# EAGLE design Nixie Clock Main Board V1.1 (EAGLE 9.6.0)
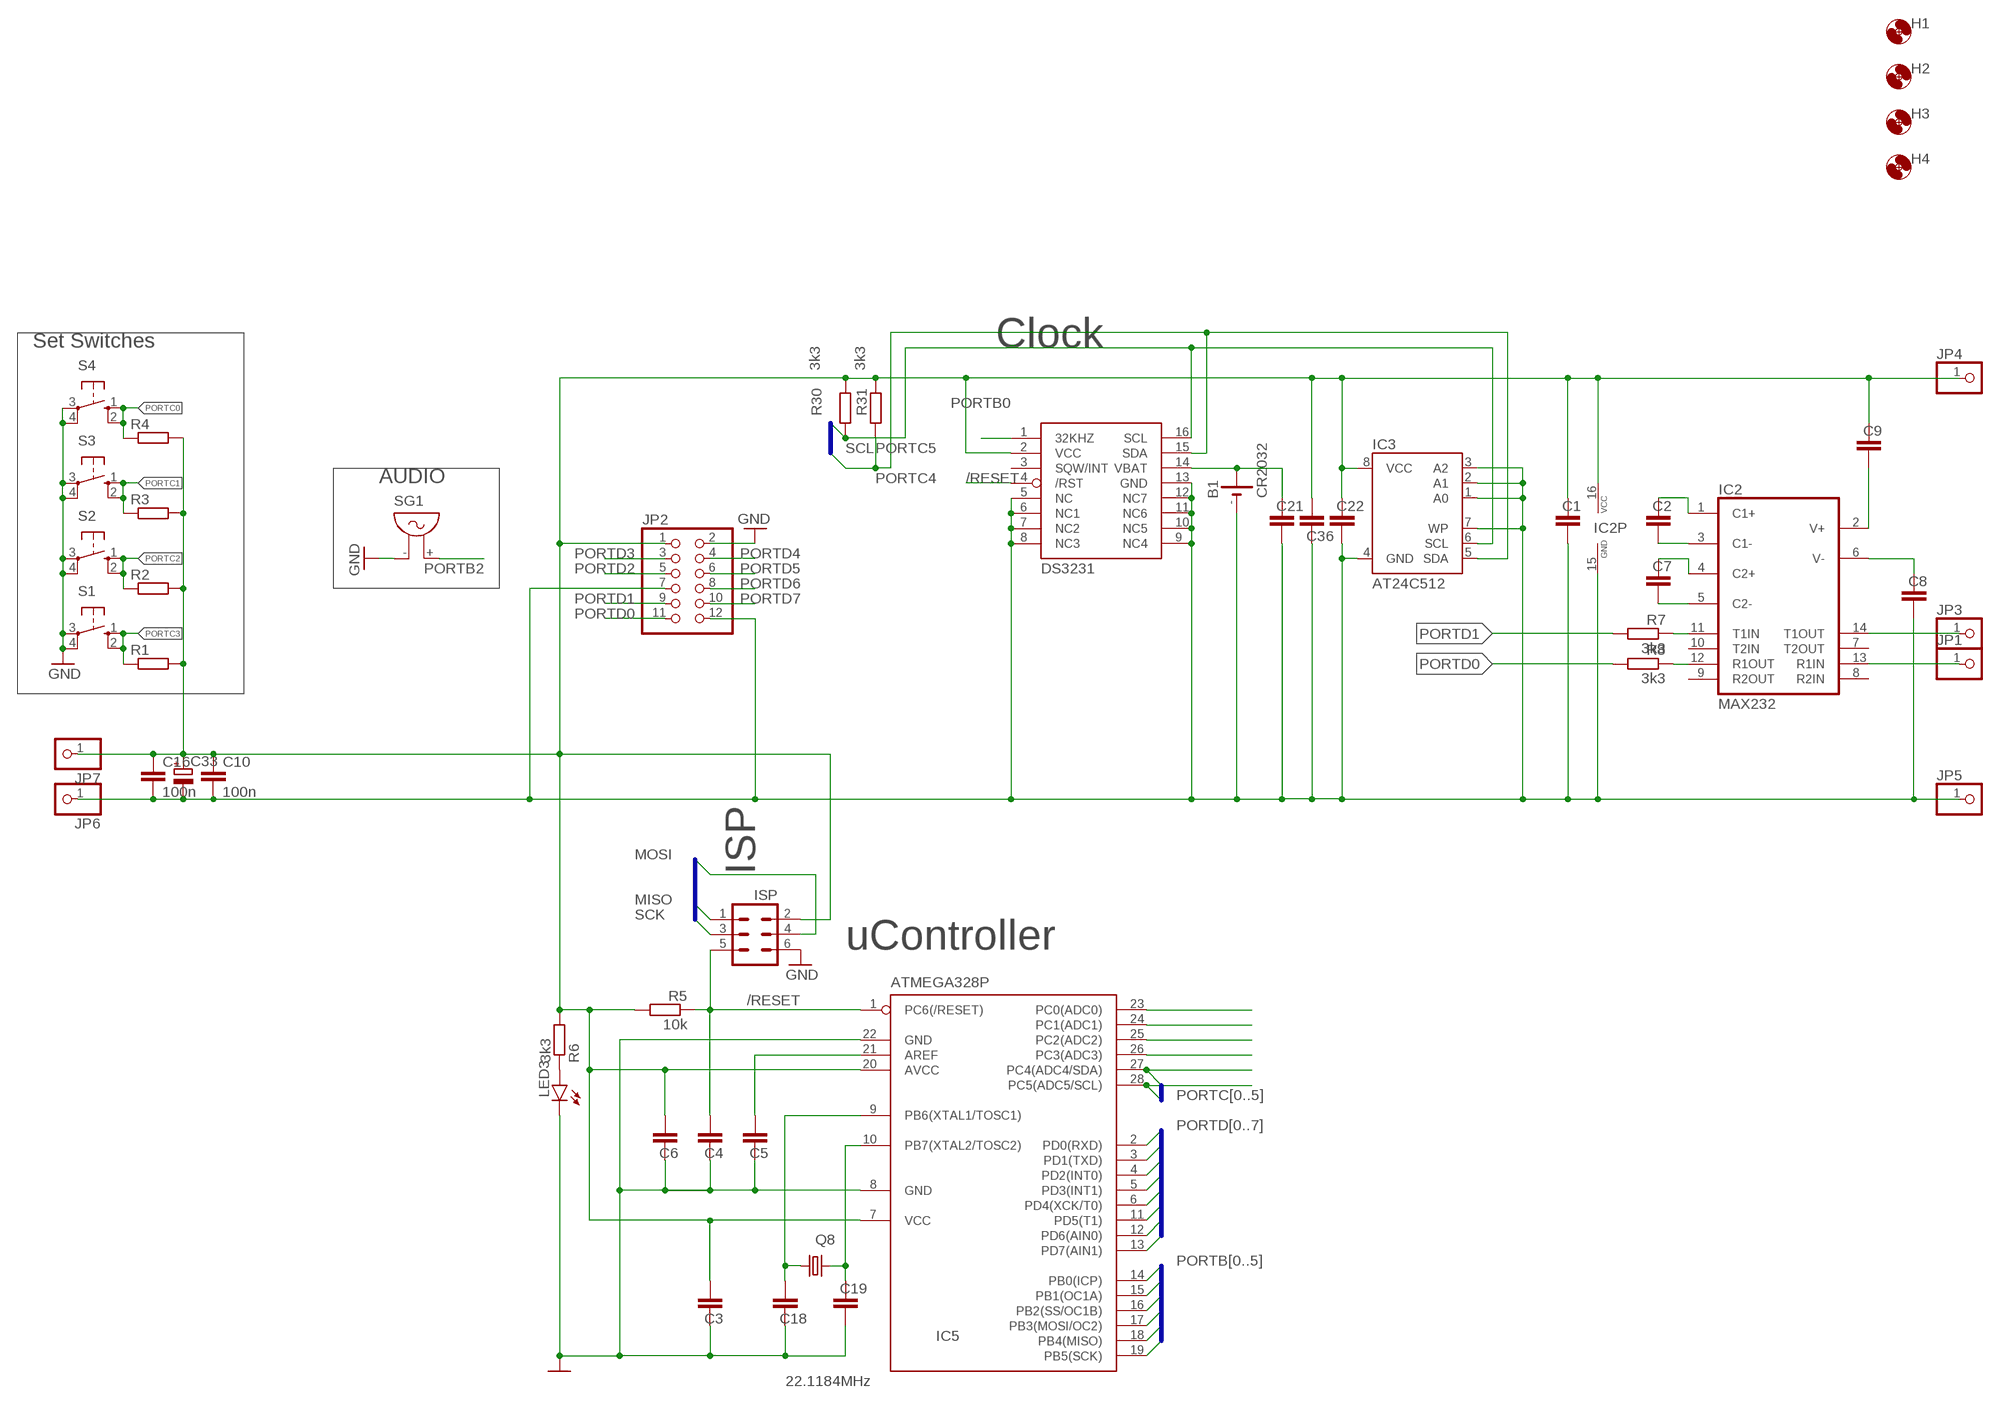
[diagram p0: schematic, sheet 1]

## Parts
B1  CR2032  [CR2032]
C1  C-EUC1206  [C1206]
C2  C-EUC1206  [C1206]
C3  C-EUC1206  [C1206]
C4  C-EUC0805  [C0805]
C5  C-EUC1206  [C1206]
C6  C-EUC1206  [C1206]
C7  C-EUC1206  [C1206]
C8  C-EUC1206  [C1206]
C9  C-EUC1206  [C1206]
C10  100n  C-EUC1206  [C1206]
C16  100n  C-EUC1206  [C1206]
C18  C-EUC0805  [C0805]
C19  C-EUC0805  [C0805]
C21  C-EUC1206  [C1206]
C22  C-EUC1206  [C1206]
C33  CPOL-EUE3.5-8  [E3,5-8]
C36  C-EUC1206  [C1206]
H1  MOUNT-HOLE3.2  [3,2]
H2  MOUNT-HOLE3.2  [3,2]
H3  MOUNT-HOLE3.2  [3,2]
H4  MOUNT-HOLE3.2  [3,2]
IC2  MAX232  [DIL16]
IC3  AT24C512  AT24CP  [DIL08]
IC5  ATMEGA328P  MEGA8-P  [DIL28-3]
J  ISP  MA03-2  [MA03-2]
JP1  PINHD-1X1  [1X01]
JP2  PINHD-2X6  [2X06]
JP3  PINHD-1X1  [1X01]
JP4  PINHD-1X1  [1X01]
JP5  PINHD-1X1  [1X01]
JP6  PINHD-1X1  [1X01]
JP7  PINHD-1X1  [1X01]
LED3  LED5MM  [LED5MM]
Q8  22.1184MHz  CRYSTALHC49U-V  [HC49U-V]
R1  R-EU_R0805  [R0805]
R2  R-EU_R0805  [R0805]
R3  R-EU_R0805  [R0805]
R4  R-EU_R0805  [R0805]
R5  10k  R-EU_R0805  [R0805]
R6  3k3  R-EU_R0805  [R0805]
R7  3k3  R-EU_R0805  [R0805]
R8  3k3  R-EU_R0805  [R0805]
R30  3k3  R-EU_R0805  [R0805]
R31  3k3  R-EU_R0805  [R0805]
S1  10-XX  [B3F-10XX]
S2  10-XX  [B3F-10XX]
S3  10-XX  [B3F-10XX]
S4  10-XX  [B3F-10XX]
SG1  F/QMX  [F/QMX]
U2  DS3231  DS3231/SO  [SO16W]

## Nets
+5V: C1.1 C3.1 C6.1 C9.1 C10.1 C16.1 C22.1 C33.+ C36.1 IC2.16(VCC) IC3.8(VCC) IC5.7(VCC) IC5.20(AVCC) J.2 JP2.1 JP4.1 JP7.1 R1.2 R2.2 R3.2 R4.2 R5.2 R6.2 R30.2 R31.2 U2.2(VCC)
/RESET: C4.1 IC5.1(PC6(/RESET)) J.5 R5.1 U2.4(/RST)
GND: B1.- C1.2 C3.2 C4.2 C5.2 C6.2 C8.2 C10.2 C16.2 C18.2 C19.2 C21.2 C22.2 C33.- C36.2 IC2.15(GND) IC3.1(A0) IC3.2(A1) IC3.3(A2) IC3.4(GND) IC3.7(WP) IC5.8(GND) IC5.22(GND) J.6 JP2.2 JP2.7 JP2.12 JP5.1 JP6.1 LED3.K(C) S1.3(P) S1.4(P1) S2.3(P) S2.4(P1) S3.3(P) S3.4(P1) S4.3(P) S4.4(P1) SG1.- U2.5(NC) U2.6(NC1) U2.7(NC2) U2.8(NC3) U2.9(NC4) U2.10(NC5) U2.11(NC6) U2.12(NC7) U2.13(GND)
MISO: IC5.18(PB4(MISO)) J.1
MOSI: IC5.17(PB3(MOSI/OC2)) J.4
N$2: C7.1 IC2.4(C2+)
N$3: C2.2 IC2.3(C1-)
N$4: C2.1 IC2.1(C1+)
N$5: C7.2 IC2.5(C2-)
N$6: C9.2 IC2.2(V+)
N$10: C8.1 IC2.6(V-)
N$11: IC2.11(T1IN) R7.1
N$12: IC2.13(R1IN) JP1.1
N$13: IC2.12(R1OUT) R8.1
N$14: IC2.14(T1OUT) JP3.1
N$17: LED3.A R6.1
N$38: C18.1 IC5.9(PB6(XTAL1/TOSC1)) Q8.1
N$39: C19.1 IC5.10(PB7(XTAL2/TOSC2)) Q8.2
N$40: B1.+ C21.1 U2.14(VBAT)
N$46: C5.1 IC5.21(AREF)
PORTB0: IC5.14(PB0(ICP)) U2.1(32KHZ)
PORTB1: IC5.15(PB1(OC1A))
PORTB2: IC5.16(PB2(SS/OC1B)) SG1.+
PORTC0: IC5.23(PC0(ADC0)) R4.1 S4.1(S) S4.2(S1)
PORTC1: IC5.24(PC1(ADC1)) R3.1 S3.1(S) S3.2(S1)
PORTC2: IC5.25(PC2(ADC2)) R2.1 S2.1(S) S2.2(S1)
PORTC3: IC5.26(PC3(ADC3)) R1.1 S1.1(S) S1.2(S1)
PORTC4: IC3.5(SDA) IC5.27(PC4(ADC4/SDA)) R31.1 U2.15(SDA)
PORTC5: IC3.6(SCL) IC5.28(PC5(ADC5/SCL)) R30.1 U2.16(SCL)
PORTD0: IC5.2(PD0(RXD)) JP2.11 R8.2
PORTD1: IC5.3(PD1(TXD)) JP2.9 R7.2
PORTD2: IC5.4(PD2(INT0)) JP2.5
PORTD3: IC5.5(PD3(INT1)) JP2.3
PORTD4: IC5.6(PD4(XCK/T0)) JP2.4
PORTD5: IC5.11(PD5(T1)) JP2.6
PORTD6: IC5.12(PD6(AIN0)) JP2.8
PORTD7: IC5.13(PD7(AIN1)) JP2.10
SCK: IC5.19(PB5(SCK)) J.3
Unconnected: IC2.7(T2OUT) IC2.8(R2IN) IC2.9(R2OUT) IC2.10(T2IN) U2.3(SQW/INT)

## Buses
PORTC[0..5]
PORTD[0..7]
PORTB[0..5]

## Notes on the sheet
- Set Switches | Clock
- SCL
- AUDIO
- ISP
- uController

## Library data of the parts
B1 = GSM:CR2032: LI BATTERY Varta
C1-C10 C16 C18 C19 C21 C22 C36 = rcl:C-EU: CAPACITOR, European symbol; SPICEPREFIX: C
C33 = rcl:CPOL-EU: POLARIZED CAPACITOR, European symbol; SPICEPREFIX: C
H1-H4 = holes:MOUNT-HOLE: MOUNTING HOLE with drill center marker
IC2 = maxim:MAX232: RS232 TRANSCEIVER; MF: MAXIM; MPN: MAX232ACPE+; OC_FARNELL: 9723773; OC_NEWARK: 68K4544
IC3 = atmel:AT24C*: 2-wire serial EEPROM; MPN: AT24C1024BW-SH-B; OC_FARNELL: 1362646; OC_NEWARK: 03P2044
IC5 = atmel:MEGA8-P: MICROCONTROLLER 8 Kbytes FLASH, 1 kbytes SRAM, 512 bytes EEPROM, USART, 4-channel 10 bit ADC, 2-channel 8 bit ADC Pin compatible with Atmega48, ATMega88, ATMega168 Source: avr.lbr; OC_FARNELL: unknown; OC_NEWARK: unknown
J = con-lstb:MA03-2: PIN HEADER; OC_FARNELL: unknown; OC_NEWARK: unknown
JP1 JP3-JP7 = pinhead:PINHD-1X1: PIN HEADER
JP2 = pinhead:PINHD-2X6: PIN HEADER
LED3 = led:LED: LED OSRAM: - CHIPLED LG R971, LG N971, LY N971, LG Q971, LY Q971, LO R971, LY R971 LH N974, LH R974 LS Q976, LO Q976, LY Q976 LO Q996 - Hyper CHIPLED LW Q18S LB Q993, LB Q99A, LB R99A - SideLED LS A670, LO A670, LY A670, LG A670, LP A670 LB A673, LV A673, LT A673, LW A673 LH A674 LY A675 LS A676, LA A676, LO A676, LY A676, LW A676 LS A679, LY A679, LG A679 - Hyper Micro SIDELED® LS Y876, LA Y876, LO Y876, LY Y876 LT Y87S - SmartLED LW L88C, LW L88S LB L89C, LB L89S, LG L890 LS L89K, LO L89K, LY L89K LS L896, LA L896, LO L896, LY L896 - TOPLED LS T670, LO T670, LY T670, LG T670, LP T670 LSG T670, LSP T670, LSY T670, LOP T670, LYG T670 LG T671, LOG T671, LSG T671 LB T673, LV T673, LT T673, LW T673 LH T674 LS T676, LA T676, LO T676, LY T676, LB T676, LH T676, LSB T676, LW T676 LB T67C, LV T67C, LT T67C, LS T67K, LO T67K, LY T67K, LW E67C LS E67B, LA E67B, LO E67B, LY E67B, LB E67C, LV E67C, LT E67C LW T67C LS T679, LY T679, LG T679 LS T770, LO T770, LY T770, LG T770, LP T770 LB T773, LV T773, LT T773, LW T773 LH T774 LS E675, LA E675, LY E675, LS T675 LS T776, LA T776, LO T776, LY T776, LB T776 LHGB T686 LT T68C, LB T68C - Hyper Mini TOPLED® LB M676 - Mini TOPLED Santana® LG M470 LS M47K, LO M47K, LY M47K Source: http://www.osram.convergy.de LUXEON: - LUMILED® LXK2-PW12-R00, LXK2-PW12-S00, LXK2-PW14-U00, LXK2-PW14-V00 LXK2-PM12-R00, LXK2-PM12-S00, LXK2-PM14-U00 LXK2-PE12-Q00, LXK2-PE12-R00, LXK2-PE12-S00, LXK2-PE14-T00, LXK2-PE14-U00 LXK2-PB12-K00, LXK2-PB12-L00, LXK2-PB12-M00, LXK2-PB14-N00, LXK2-PB14-P00, LXK2-PB14-Q00 LXK2-PR12-L00, LXK2-PR12-M00, LXK2-PR14-Q00, LXK2-PR14-R00 LXK2-PD12-Q00, LXK2-PD12-R00, LXK2-PD12-S00 LXK2-PH12-R00, LXK2-PH12-S00 LXK2-PL12-P00, LXK2-PL12-Q00, LXK2-PL12-R00 Source: www.luxeon.com KINGBRIGHT: KA-3528ASYC Source: www.kingbright.com
Q8 = crystal:CRYSTAL: CRYSTAL; OC_FARNELL: 1666969; OC_NEWARK: unknown
R1-R8 R30 R31 = rcl:R-EU_: RESISTOR, European symbol; SPICEPREFIX: R
S1-S4 = switch-omron:10-XX: OMRON SWITCH; MPN: B3F-1000; OC_FARNELL: 176432; OC_NEWARK: 36M3542
SG1 = buzzer:F/QMX: BUZZER Source: Buerklin; OC_FARNELL: unknown; OC_NEWARK: unknown
U2 = adafruit:DS3231

## Board
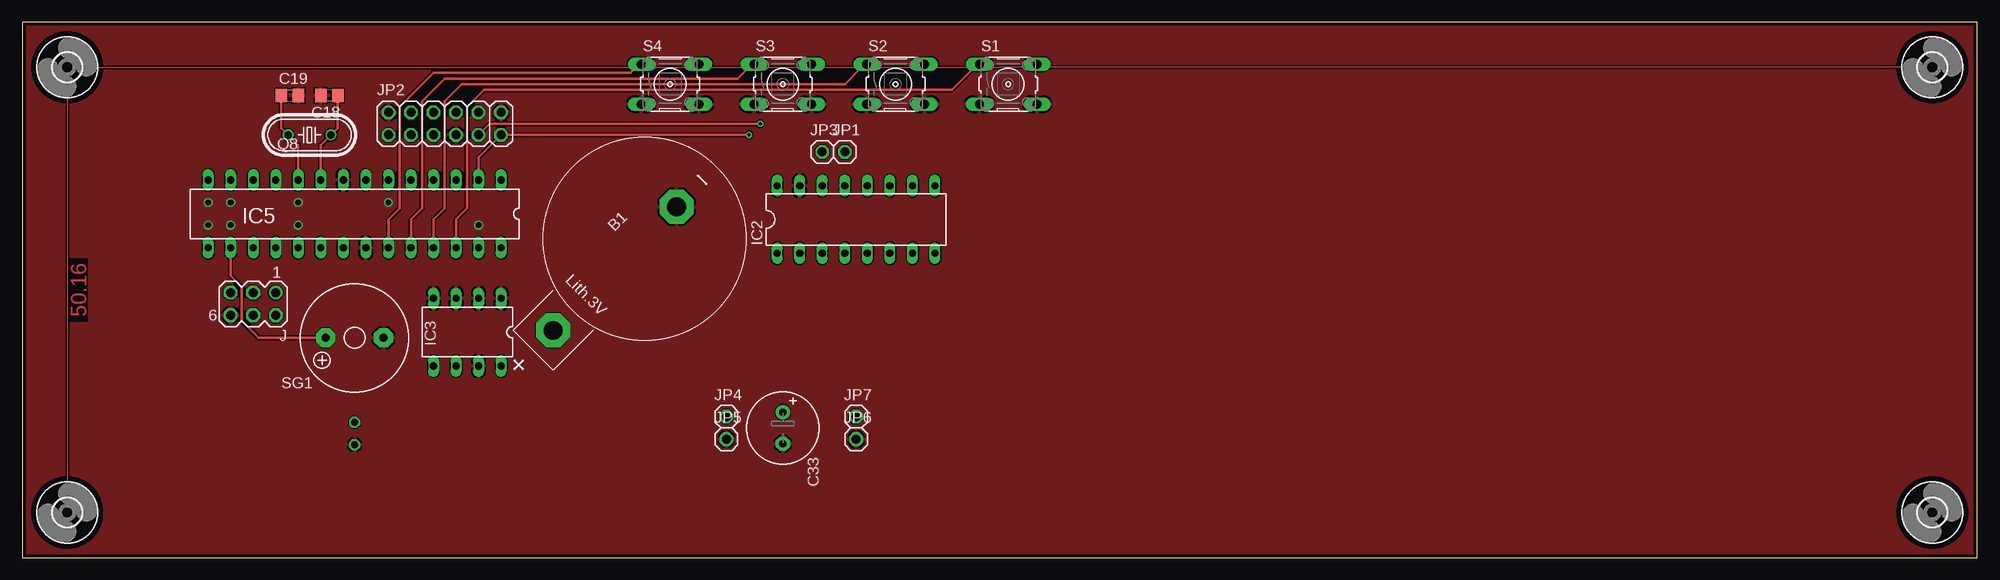
[diagram p1: board, top side]
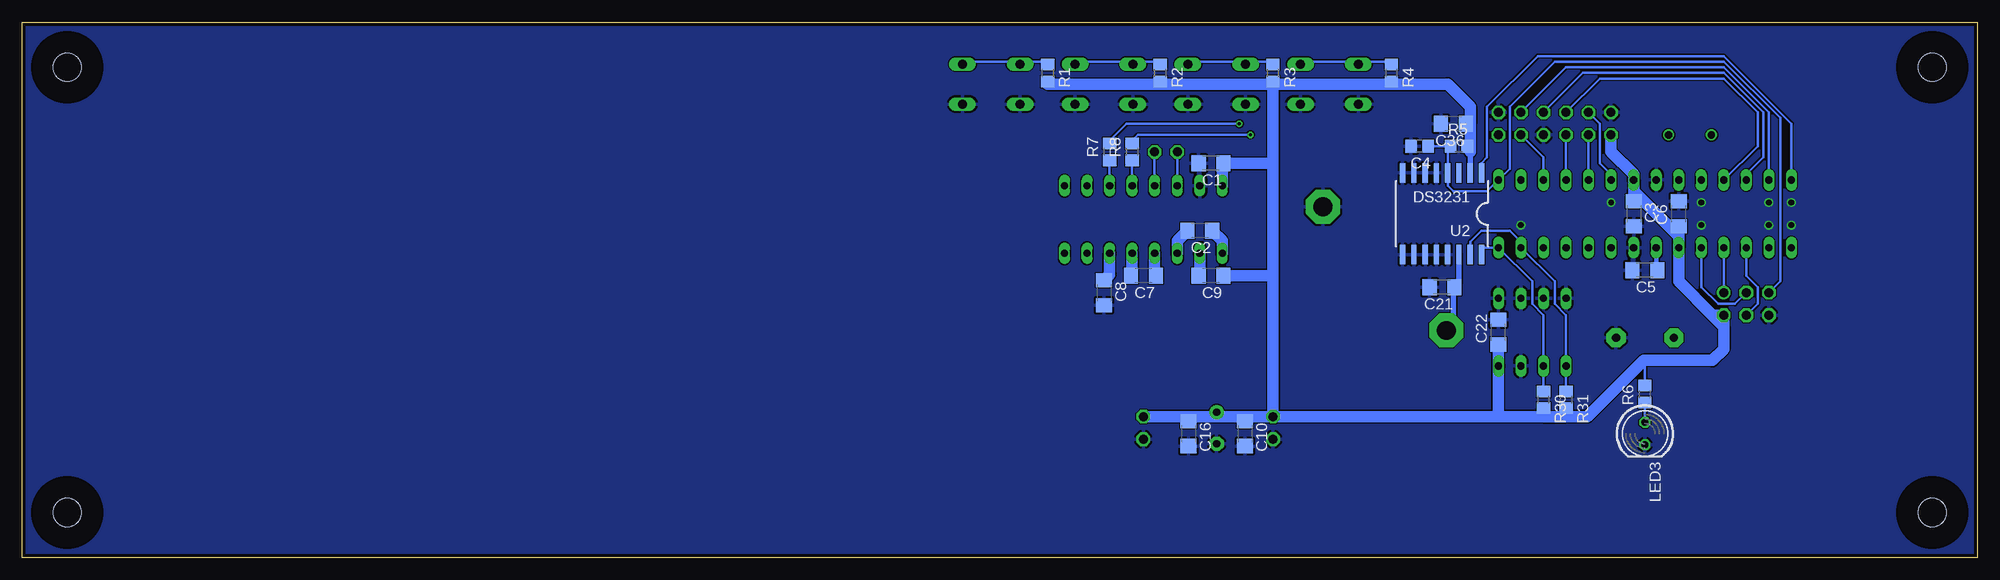
[diagram p2: board, bottom side, seen from below]

Size 220.34 x 60.33 mm. Coordinates in mm from the lower left corner, seen from the top.
Outline: 0,60.33 0,0 220.34,0 220.34,60.33 0,60.33
Copper layers (1*16): Top 0.0356mm / dielectric 1.5011mm / Bottom 0.0356mm
Design rules "LaenPCBOrder": minimum track width 6mil, minimum drill 13mil, track to track 6mil, track to pad 6mil, pad to pad 6mil, via to via 6mil, smd to smd 6mil, copper to edge 15mil, drill to drill 6mil, minimum pad ring 7mil, minimum via ring 7mil, stop-mask expansion 3mil, vias tented up to drill 0mil, thermal gap 10mil

### Footprints (pad centres in the part's own frame; a part is rotated, then mirrored left to right if it is on the bottom)
CR2032 = drill 2.1 pad 3.81 octagon: + -4.445,11.43; - -4.445,-8.255
C1206 = smd 1.6 x 1.8: 1 -1.4,0; 2 1.4,0
C0805 = smd 1.3 x 1.5: 1 -0.95,0; 2 0.95,0
E3,5-8 = drill 0.813 pad 1.6: + -1.778,0 | drill 0.813 pad 1.6 octagon: - 1.778,0
3,2 = hole 3.2: 0,0
DIL16 = drill 0.813 long: 1 -8.89,-3.81; 2 -6.35,-3.81; 3 -3.81,-3.81; 4 -1.27,-3.81; 5 1.27,-3.81; 6 3.81,-3.81; 7 6.35,-3.81; 8 8.89,-3.81; 9 8.89,3.81; 10 6.35,3.81; 11 3.81,3.81; 12 1.27,3.81; 13 -1.27,3.81; 14 -3.81,3.81; 15 -6.35,3.81; 16 -8.89,3.81
DIL08 = drill 0.813 long: 1 -3.81,-3.81; 2 -1.27,-3.81; 3 1.27,-3.81; 4 3.81,-3.81; 5 3.81,3.81; 6 1.27,3.81; 7 -1.27,3.81; 8 -3.81,3.81
DIL28-3 = drill 0.813 long: 1 -16.51,-3.81; 2 -13.97,-3.81; 3 -11.43,-3.81; 4 -8.89,-3.81; 5 -6.35,-3.81; 6 -3.81,-3.81; 7 -1.27,-3.81; 8 1.27,-3.81; 9 3.81,-3.81; 10 6.35,-3.81; 11 8.89,-3.81; 12 11.43,-3.81; 13 13.97,-3.81; 14 16.51,-3.81; 15 16.51,3.81; 16 13.97,3.81; 17 11.43,3.81; 18 8.89,3.81; 19 6.35,3.81; 20 3.81,3.81; 21 1.27,3.81; 22 -1.27,3.81; 23 -3.81,3.81; 24 -6.35,3.81; 25 -8.89,3.81; 26 -11.43,3.81; 27 -13.97,3.81; 28 -16.51,3.81
MA03-2 = drill 1.016: 1 -2.54,-1.27 | drill 1.016 octagon: 2 -2.54,1.27; 3 0,-1.27; 4 0,1.27; 5 2.54,-1.27; 6 2.54,1.27
1X01 = drill 1.016 octagon: 1 0,0
2X06 = drill 1.016 octagon: 1 -6.35,-1.27; 2 -6.35,1.27; 3 -3.81,-1.27; 4 -3.81,1.27; 5 -1.27,-1.27; 6 -1.27,1.27; 7 1.27,-1.27; 8 1.27,1.27; 9 3.81,-1.27; 10 3.81,1.27; 11 6.35,-1.27; 12 6.35,1.27
LED5MM = drill 0.813 octagon: A -1.27,0; K 1.27,0
HC49U-V = drill 0.813: 1 -2.413,0; 2 2.413,0
R0805 = smd 1.3 x 1.5: 1 -0.95,0; 2 0.95,0
B3F-10XX = drill 1.016 long: 1 -3.251,2.261; 2 3.251,2.261; 3 -3.251,-2.261; 4 3.251,-2.261
F/QMX = drill 0.914 pad 2.159 octagon: + 3.251,0; - -3.251,0
SO16W = smd 0.6 x 2.2: 1 -4.445,-4.6; 2 -3.175,-4.6; 3 -1.905,-4.6; 4 -0.635,-4.6; 5 0.635,-4.6; 6 1.905,-4.6; 7 3.175,-4.6; 8 4.445,-4.6; 9 4.445,4.6; 10 3.175,4.6; 11 1.905,4.6; 12 0.635,4.6; 13 -0.635,4.6; 14 -1.905,4.6; 15 -3.175,4.6; 16 -4.445,4.6

### Placement (x,y rotation side)
B1  64.77,36.83 135 top
C1  86.36,44.45 180 bottom
C2  87.63,36.83 180 bottom
C3  38.73,38.73 270 bottom
C4  62.87,46.35 180 bottom
C5  37.47,32.38 180 bottom
C6  33.66,38.73 90 bottom
C7  93.98,31.75 180 bottom
C8  98.42,29.84 270 bottom
C9  86.36,31.75 180 bottom
C10  82.55,13.97 270 bottom
C16  88.9,13.97 270 bottom
C18  34.61,52.07 180 top
C19  30.16,52.07 0 top
C21  60.33,30.48 180 bottom
C22  53.98,25.4 90 bottom
C33  85.72,14.61 270 top
C36  59.05,48.9 180 bottom
H1  5.08,5.08 0 top
H2  5.08,55.24 0 top
H3  215.26,55.24 0 top
H4  215.26,5.08 0 top
IC2  93.98,38.1 0 top
IC3  50.16,25.4 180 top
IC5  37.47,38.73 180 top
J  26.04,28.57 180 top
JP1  92.71,45.72 0 top
JP2  47.62,48.9 0 top
JP3  90.17,45.72 0 top
JP4  79.38,15.88 0 top
JP5  79.38,13.34 0 top
JP6  93.98,13.34 0 top
JP7  93.98,15.88 0 top
LED3  37.47,13.97 270 bottom
Q8  32.38,47.62 180 top
R1  104.78,54.61 270 bottom
R2  92.08,54.61 270 bottom
R3  79.38,54.61 270 bottom
R4  66.04,54.61 270 bottom
R5  58.42,46.35 0 bottom
R6  37.47,18.41 90 bottom
R7  97.79,45.72 90 bottom
R8  95.25,45.72 90 bottom
R30  48.9,17.78 270 bottom
R31  46.35,17.78 270 bottom
S1  111.12,53.34 0 top
S2  98.42,53.34 0 top
S3  85.72,53.34 0 top
S4  73.03,53.34 0 top
SG1  37.47,24.77 180 top
U2  60.33,38.73 180 bottom

### Tracks (layer width: path | path; a pad name or v marks a point on that pad's centre or on a via)
+5V
  Bottom 0.152: R5.2 57.15,46.35
  Bottom 0.254: R4.2 66.04,53.34 | R3.2 79.38,53.34 | R2.2 92.08,53.34 | C36.1 57.15,48.9 | R1.2 104.78,53.34
  Bottom 0.305: R6.2 37.47,22.1 37.59,22.23
  Bottom 0.61: U2.2 57.15,45.72
  Bottom 1.27: C22.1 IC3.8 53.98,15.88 | IC5.7 C3.1 | IC5.7 38.73,41.27 33.66,36.2 IC5.20 | IC5.20 C6.1 | 28.57,26.04 J.2 29.84,27.3 | IC5.7 38.73,43.18 41.27,45.72 JP2.1 | 48.9,15.88 53.98,15.88 | 48.9,15.88 R30.2 | 48.9,15.88 46.35,15.88 | 46.35,15.88 R31.2 | 46.35,15.88 43.94,15.88 37.59,22.23 29.84,22.23 28.57,23.5 28.57,26.04 | 104.78,53.34 92.08,53.34 79.38,53.34 66.04,53.34 59.69,53.34 57.15,50.8 57.15,48.9 57.15,46.35 57.15,45.72 | R3.2 79.38,44.45 | 29.84,27.3 33.66,31.11 IC5.20 | 29.84,27.3 28.57,26.04 | IC2.16 85.09,44.32 C1.1 79.38,44.45 | 79.38,44.45 79.38,31.75 | 79.38,31.75 C9.1 | 79.38,31.75 JP4.1 | 53.98,15.88 JP4.1 | JP4.1 82.55,15.88 | 82.55,15.88 85.22,15.88 | 85.22,15.88 C33.+ 86.23,15.88 | C10.1 82.55,15.88 | 86.23,15.88 88.9,15.88 | 88.9,15.88 JP7.1 | C16.1 88.9,15.88 | 85.22,15.88 86.23,15.88
/RESET
  Bottom 0.254: J.5 22.23,31.11 22.23,49.53 28.57,55.88 47.62,55.88 52.7,50.8 52.7,43.81 IC5.1 55.24,41.27 59.05,41.27 59.69,41.91 U2.4 59.69,46.35 | 59.69,46.03 R5.1 59.69,46.35 | 59.69,46.35 62.23,46.35
  Bottom 0.305: 62.23,46.35 C4.1
GND  (via drill 0.65)
  other vias: 31.11,40.01 20.95,37.47 20.95,40.01 31.11,37.47 51.44,37.47 41.27,40.01 23.5,40.01 23.5,37.47
  pour Bottom: 0,60.33 220.34,60.33 220.34,0 0,0
  pour Top: 0,60.33 220.34,60.33 220.34,0 0,0
MISO
  Bottom 0.254: IC5.18 J.1
MOSI
  Bottom 0.254: IC5.17 26.04,31.75 24.77,30.48 24.77,28.57 J.4
N$2
  Bottom 1.27: IC2.4 92.71,31.88 C7.1
N$3
  Bottom 1.27: IC2.3 90.17,35.69 C2.2
N$4
  Bottom 1.27: C2.1 85.09,35.69 IC2.1
N$5
  Bottom 1.27: IC2.5 95.25,31.88 C7.2
N$6
  Bottom 1.27: IC2.2 87.63,31.88 C9.2
N$10
  Bottom 1.27: C8.1 97.79,31.88 IC2.6
N$11
  Bottom 0.254: IC2.11 R7.1
N$12
  Bottom 0.254: IC2.13 JP1.1
N$13
  Bottom 0.254: IC2.12 R8.1
N$14
  Bottom 0.254: IC2.14 JP3.1
N$17
  Bottom 0.305: LED3.A R6.1
N$38
  Top 0.254: IC5.9 33.66,46.48 Q8.1 35.56,48.39 C18.1
N$39
  Top 0.254: IC5.10 31.11,46.48 Q8.2 29.21,48.38 C19.1
N$40
  Bottom 0.61: U2.14 58.42,30.98 C21.1 59.05,30.35 59.05,26.04 59.48,25.61 B1.+
N$46
  Bottom 0.508: IC5.21 36.2,32.52 C5.1
PORTB0
  Bottom 0.254: IC5.14 20.95,48.9 28.57,56.52 49.53,56.52 55.24,50.8 55.24,45.09 55.88,44.45 U2.1
PORTB2
  Top 0.305: IC5.16 23.5,31.75 24.77,30.48 24.77,26.67 26.67,24.77 SG1.+
PORTC0
  Top 0.254: IC5.23 41.27,38.1 42.55,39.37 42.55,50.8 46.35,54.61 68.58,54.61 69.57,55.6 S4.1
  Bottom 0.254: R4.1 66.36,55.56 66.67,55.88 69.49,55.88 S4.1 70.05,55.88 76,55.88 S4.2
PORTC1
  Top 0.254: IC5.24 43.81,38.1 45.09,39.37 45.09,51.44 47.62,53.98 80.64,53.98 82.27,55.6 S3.1
  Bottom 0.254: R3.1 79.69,55.88 82.19,55.88 S3.1 82.75,55.88 88.7,55.88 S3.2
PORTC2
  Top 0.254: IC5.25 46.35,38.1 47.62,39.37 47.62,51.44 49.53,53.34 92.71,53.34 94.61,55.24 94.82,55.24 S2.1
  Bottom 0.254: R2.1 92.39,55.88 94.89,55.88 S2.1 95.45,55.88 101.4,55.88 S2.2
PORTC3
  Top 0.254: IC5.26 48.9,38.1 50.16,39.37 50.16,50.8 52.07,52.7 104.78,52.7 107.31,55.24 107.52,55.24 S1.1
  Bottom 0.254: R1.1 105.09,55.88 107.59,55.88 S1.1 108.15,55.88 114.1,55.88 S1.2
PORTC4
  Bottom 0.254: R31.1 IC3.5 46.35,27.3 47.62,28.57 47.62,31.11 IC5.27 51.44,35.56 52.7,36.83 55.88,36.83 57.15,35.56 U2.15
PORTC5
  Bottom 0.254: R30.1 IC3.6 48.9,27.3 50.16,28.57 50.16,31.11 IC5.28 55.88,34.92 U2.16
PORTD0  (via drill 0.35)
  Top 0.254: IC5.2 51.44,45.09 JP2.11 v81.92,47.62
  Bottom 0.254: R8.2 95.25,46.99 94.61,47.62 v81.92,47.62
PORTD1  (via drill 0.35)
  Top 0.254: JP2.9 52.7,48.9 v83.19,48.9
  Bottom 0.254: IC5.3 48.9,45.09 JP2.9 | v83.19,48.9 95.89,48.9 97.79,46.99 R7.2
PORTD2
  Bottom 0.254: IC5.4 JP2.5
PORTD3
  Bottom 0.254: JP2.3 IC5.5
PORTD4
  Bottom 0.254: IC5.6 41.27,43.18 42.55,44.45 42.55,48.9 JP2.4
PORTD5
  Bottom 0.254: IC5.11 24.77,46.35 24.77,50.16 28.57,53.98 42.55,53.98 JP2.6
PORTD6
  Bottom 0.254: IC5.12 26.04,43.18 24.13,45.09 24.13,50.16 28.57,54.61 44.45,54.61 JP2.8
PORTD7
  Bottom 0.254: IC5.13 23.5,50.16 28.57,55.24 46.35,55.24 JP2.10
SCK
  Bottom 0.254: IC5.19 31.11,30.48 29.21,28.57 27.3,28.57 J.3
(copper drawn outside any net)
  shapes: Top area x2